# Altium schematic sheet PWR.SchDoc
size A4
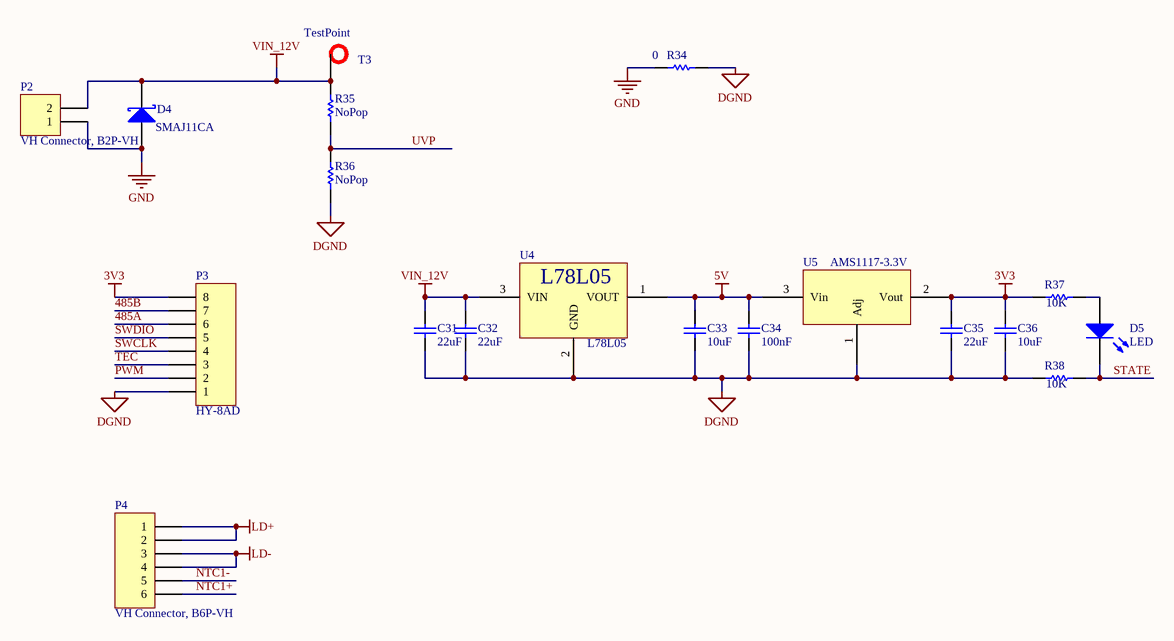
[diagram p0: PWR.SchDoc]

## Parts
C31  22uF  [1608[0603]]
C32  22uF  [1608[0603]]
C33  10uF  [1608[0603]]
C34  100nF  [1608[0603]]
C35  22uF  [1608[0603]]
C36  10uF  [1608[0603]]
D4  SMAJ11CA  [SMA_DIOM5226X26N]
D5  LED  [2012[0805] - LED]
P2  VH Connector, B2P-VH  [2PIN-B2P_VH]
P3  HY-8AD  [8P -HY-8AD]
P4  VH Connector, B6P-VH  [6PIN-B6P_VH]
R34  0  [2012[0805]]
R35  NoPop  [1608[0603]]
R36  NoPop  [1608[0603]]
R37  10K  [1608[0603]]
R38  10K  [1608[0603]]
T3  Test Point  [TestPoint]  (value not drawn)
U4  L78L05  [SOT89-150P410X160-3N]
U5  AMS1117-3.3V  [SOT89-150P410X160-3N]

## Nets
3V3: C35.2 C36.2 P3.8 R37.2 U5.2(Vout)
5V: C33.2 C34.2 U4.1(VOUT) U5.3(Vin)
DGND: C31.1 C32.1 C33.1 C34.1 C35.1 C36.1 P3.1 R34.1 R36.1 R38.2 U4.2(GND) U5.1(Adj)
GND: D4.1(A) P2.1 R34.2
LD+: P4.1 P4.2
LD-: P4.3 P4.4
VIN_12V: C31.2 C32.2 D4.2(K) P2.2 R35.2 T3.1(TP) U4.3(VIN)
485A: P3.6
485B: P3.7
NTC1+: P4.6
NTC1-: P4.5
PWM: P3.2
STATE: D5.2(K) R38.1
SWCLK: P3.4
SWDIO: P3.5
TEC: P3.3
UVP: R35.1 R36.2
NetD5_1: D5.1(A) R37.1

## Notes on the sheet
- (in symbol TP) TestPoint

## Library data of the parts
C31-C36 = Cap: Capacitor; Published: 8-Jun-2000; LatestRevisionDate: 17-Jul-2002; LatestRevisionNote: Re-released for DXP Platform.; PackageReference: RAD-0.3; Publisher: Altium Limited; PackageDescription: Radial Cap, Thru-Hole; 2 Leads; 0.3 in Pin Spacing
  C31 C32 C35: Value: 22uF
  C33 C36: Value: 10uF
  C34: Value: 100nF
D4 = D Schottky: Schottky Diode; Published: 8-Jun-2000; LatestRevisionDate: 17-Jul-2002; LatestRevisionNote: Re-released for DXP Platform.; PackageReference: SMB; Publisher: Altium Limited; PackageDescription: DO-214-AA/SMB; 2 C-Bend Leads; Body 5.3 x 3.6 mm, inc. leads (LxW); Code_JEDEC: DO-214-AA
D5 = LED0: Typical INFRARED GaAs LED; Published: 8-Jun-2000; LatestRevisionDate: 08-Jul-2005; LatestRevisionNote: Mech Layer 1 removed.; PackageReference: LED-0; Publisher: Altium Limited; PackageDescription: LED; 2 Leads
P2 = Header 2: Header, 2-Pin; LatestRevisionDate: 17-Jul-2002; LatestRevisionNote: Re-released for DXP Platform.; Publisher: Altium Limited
P3 = Header 8: Header, 8-Pin; LatestRevisionDate: 17-Jul-2002; LatestRevisionNote: Re-released for DXP Platform.; Publisher: Altium Limited
P4 = Header 6: Header, 6-Pin; LatestRevisionDate: 17-Jul-2002; LatestRevisionNote: Re-released for DXP Platform.; Publisher: Altium Limited
R34 R37 R38 = Res1: Resistor; Published: 8-Jun-2000; LatestRevisionDate: 17-Jul-2002; LatestRevisionNote: Re-released for DXP Platform.; PackageReference: AXIAL-0.3; Publisher: Altium Limited; PackageDescription: Axial Device, Thru-Hole; 2 Leads; 0.3 in Pin Spacing
  R34: Value: 0
  R37 R38: Value: 10K
R35 = Res1: Resistor; Value: 20k; Published: 8-Jun-2000; LatestRevisionDate: 17-Jul-2002; LatestRevisionNote: Re-released for DXP Platform.; PackageReference: AXIAL-0.3; Publisher: Altium Limited; PackageDescription: Axial Device, Thru-Hole; 2 Leads; 0.3 in Pin Spacing
R36 = Res1: Resistor; Value: 2k; Published: 8-Jun-2000; LatestRevisionDate: 17-Jul-2002; LatestRevisionNote: Re-released for DXP Platform.; PackageReference: AXIAL-0.3; Publisher: Altium Limited; PackageDescription: Axial Device, Thru-Hole; 2 Leads; 0.3 in Pin Spacing
T3 = TP
U4 = PWR_L78L05: POSITIVE VOLTAGE REGULATORS
U5 = PWR_LM1XXX: 5V转3V3 10mA  DC/DC